# EAGLE design current_sensor (EAGLE 7.6.0)
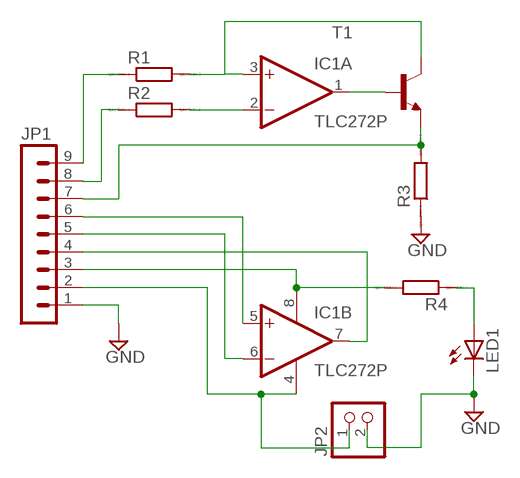
[diagram p0: schematic, sheet 1]

## Parts
IC1  TLC272P  [DIL08]
JP1  MA09-1  [MA09-1]
JP2  PINHD-1X2  [1X02]
LED1  LEDCHIP-LED0805  [CHIP-LED0805]
R1  R  [R0805]
R2  R  [R0805]
R3  R  [R0805]
R4  R  [R0805]
T1  BF422-NPN-TO92-BCE  [TO92-BCE]

## Nets
GND: JP1.1 JP2.2 LED1.C R3.1
N$1: JP1.7 R3.2 T1.E
N$2: IC1.1(A:OUT) T1.B
N$3: IC1.2(A:-IN) R2.2
N$4: IC1.3(A:+IN) R1.2 T1.C
N$5: JP1.9 R1.1
N$6: JP1.8 R2.1
N$7: LED1.A R4.1
N$8: IC1.5(B:+IN) JP1.6
N$9: IC1.6(B:-IN) JP1.5
N$10: IC1.7(B:OUT) JP1.4
N$12: IC1.4(P:V-) JP1.2 JP2.1
N$13: IC1.8(P:V+) JP1.3 R4.2

## Library data of the parts
IC1 = linear:TLC272: OP AMP
JP1 = con-lstb:MA09-1: PIN HEADER; OC_FARNELL: unknown; OC_NEWARK: unknown
JP2 = pinhead:PINHD-1X2: PIN HEADER
LED1 = led:LED: LED OSRAM: - CHIPLED LG R971, LG N971, LY N971, LG Q971, LY Q971, LO R971, LY R971 LH N974, LH R974 LS Q976, LO Q976, LY Q976 LO Q996 - Hyper CHIPLED LW Q18S LB Q993, LB Q99A, LB R99A - SideLED LS A670, LO A670, LY A670, LG A670, LP A670 LB A673, LV A673, LT A673, LW A673 LH A674 LY A675 LS A676, LA A676, LO A676, LY A676, LW A676 LS A679, LY A679, LG A679 - Hyper Micro SIDELED® LS Y876, LA Y876, LO Y876, LY Y876 LT Y87S - SmartLED LW L88C, LW L88S LB L89C, LB L89S, LG L890 LS L89K, LO L89K, LY L89K LS L896, LA L896, LO L896, LY L896 - TOPLED LS T670, LO T670, LY T670, LG T670, LP T670 LSG T670, LSP T670, LSY T670, LOP T670, LYG T670 LG T671, LOG T671, LSG T671 LB T673, LV T673, LT T673, LW T673 LH T674 LS T676, LA T676, LO T676, LY T676, LB T676, LH T676, LSB T676, LW T676 LB T67C, LV T67C, LT T67C, LS T67K, LO T67K, LY T67K, LW E67C LS E67B, LA E67B, LO E67B, LY E67B, LB E67C, LV E67C, LT E67C LW T67C LS T679, LY T679, LG T679 LS T770, LO T770, LY T770, LG T770, LP T770 LB T773, LV T773, LT T773, LW T773 LH T774 LS E675, LA E675, LY E675, LS T675 LS T776, LA T776, LO T776, LY T776, LB T776 LHGB T686 LT T68C, LB T68C - Hyper Mini TOPLED® LB M676 - Mini TOPLED Santana® LG M470 LS M47K, LO M47K, LY M47K Source: http://www.osram.convergy.de LUXEON: - LUMILED® LXK2-PW12-R00, LXK2-PW12-S00, LXK2-PW14-U00, LXK2-PW14-V00 LXK2-PM12-R00, LXK2-PM12-S00, LXK2-PM14-U00 LXK2-PE12-Q00, LXK2-PE12-R00, LXK2-PE12-S00, LXK2-PE14-T00, LXK2-PE14-U00 LXK2-PB12-K00, LXK2-PB12-L00, LXK2-PB12-M00, LXK2-PB14-N00, LXK2-PB14-P00, LXK2-PB14-Q00 LXK2-PR12-L00, LXK2-PR12-M00, LXK2-PR14-Q00, LXK2-PR14-R00 LXK2-PD12-Q00, LXK2-PD12-R00, LXK2-PD12-S00 LXK2-PH12-R00, LXK2-PH12-S00 LXK2-PL12-P00, LXK2-PL12-Q00, LXK2-PL12-R00 Source: www.luxeon.com KINGBRIGHT: KA-3528ASYC Source: www.kingbright.com
R1-R4 = eagle-ltspice:R: RESISTOR, European symbol; SPICEMODEL: NONE; SPICEPREFIX: R
T1 = transistor:*-NPN-: NPN Transistror BF959 corrected 2008.03.06

## Board
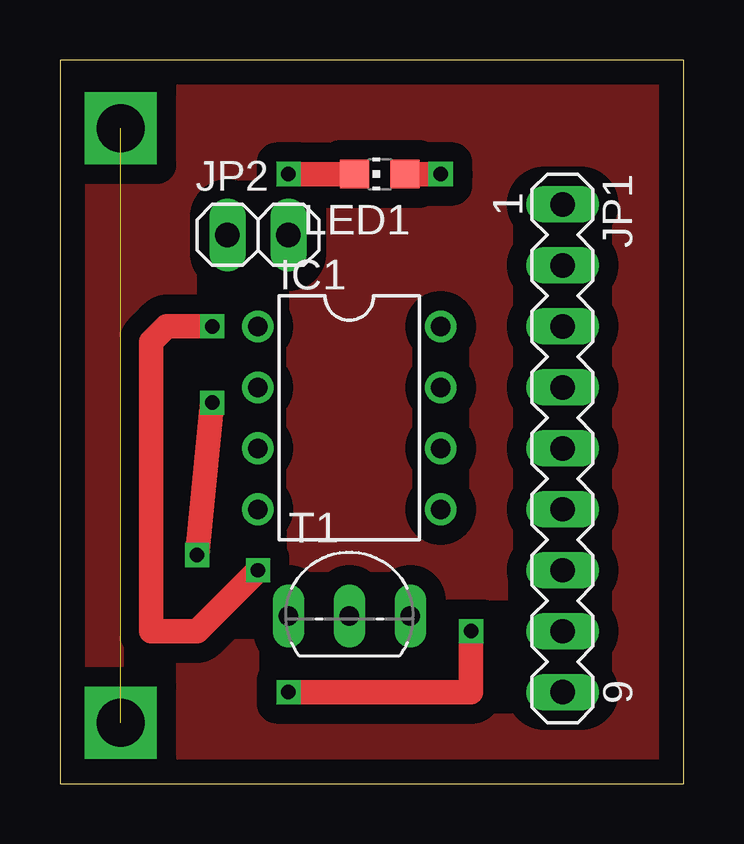
[diagram p1: board, top side]
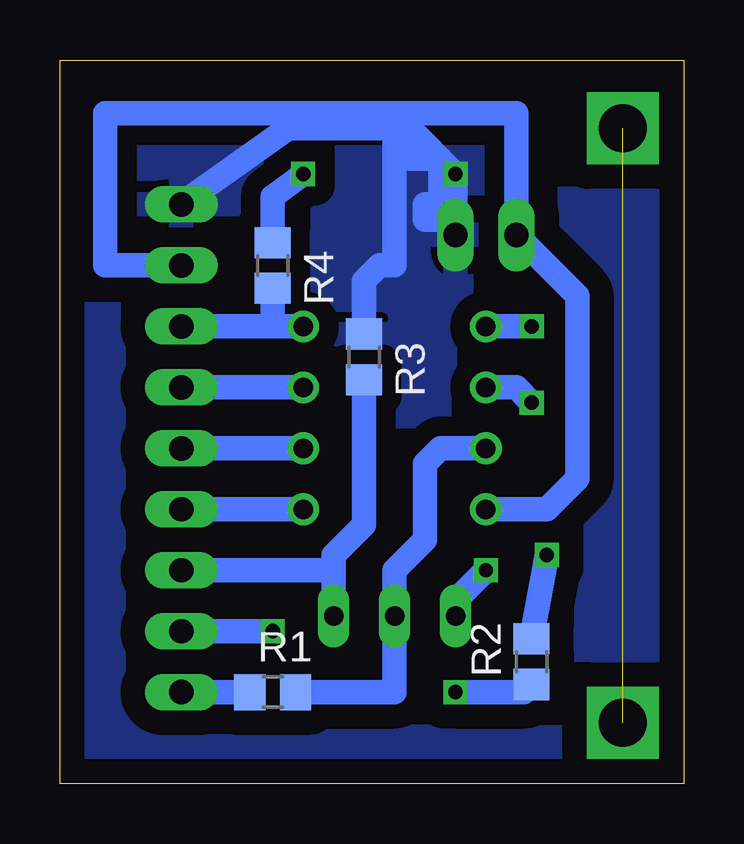
[diagram p2: board, bottom side, seen from below]

Size 26.02 x 30.15 mm. Coordinates in mm from the lower left corner, seen from the top.
Outline: 0,0 26.02,0 26.02,30.15 0,30.15 0,0
Copper layers (1*16): Top 0.035mm / dielectric 1.5mm / Bottom 0.035mm
Design rules "default": minimum track width 10mil, minimum drill 24mil, track to track 8mil, track to pad 8mil, pad to pad 8mil, via to via 8mil, smd to smd 8mil, copper to edge 40mil, drill to drill 8mil, minimum pad ring 10mil, minimum via ring 8mil, stop-mask expansion 4mil, vias tented up to drill 0mil, thermal gap 10mil

### Footprints (pad centres in the part's own frame; a part is rotated, then mirrored left to right if it is on the bottom)
DIL08 = drill 0.813 pad 1.27: 1 -3.81,-3.81; 2 -1.27,-3.81; 3 1.27,-3.81; 4 3.81,-3.81; 5 3.81,3.81; 6 1.27,3.81; 7 -1.27,3.81; 8 -3.81,3.81
MA09-1 = drill 1.016 long: 1 -10.16,0; 2 -7.62,0; 3 -5.08,0; 4 -2.54,0; 5 0,0; 6 2.54,0; 7 5.08,0; 8 7.62,0; 9 10.16,0
1X02 = drill 1.016 long: 1 -1.27,0; 2 1.27,0
CHIP-LED0805 = smd 1.2 x 1.2: A 0,-1.05; C 0,1.05
R0805 = smd 1.3 x 1.5: 1 -0.95,0; 2 0.95,0
TO92-BCE = drill 0.813 long: B -2.54,0; C 0,0; E 2.54,0

### Placement (x,y rotation side)
IC1  12.06,15.24 270 top
JP1  20.96,13.97 270 top
JP2  8.26,22.86 0 top
LED1  13.33,25.4 90 top
R1  17.15,3.81 0 bottom
R2  6.35,5.08 90 bottom
R3  13.33,17.78 270 bottom
R4  17.15,21.59 270 bottom
T1  12.06,6.99 0 top

### Tracks (layer width: path | path; a pad name or v marks a point on that pad's centre or on a via)
GND  (via drill 0.6)
  Top 1.016: LED1.C v9.53,25.4
  Bottom 1.016: v9.53,25.4 JP2.2 | R3.1 13.33,20.95 12.7,21.59 12.06,21.59 12.06,27.3 | 12.06,27.3 16.51,27.3 JP1.1 | 12.06,27.3 11.43,27.3 v9.53,25.4 | v9.53,25.4 9.53,24.13 10.79,24.13 10.79,23.5 10.16,23.5 10.16,26.04 11.43,26.04 11.43,26.67
  pour Bottom (isolate 0.813): -0.64,33.02 -0.64,-2.54 27.31,-2.54 27.31,33.02
N$1
  Bottom 1.016: T1.E 14.61,8.89 | 14.61,8.89 14.61,9.53 13.33,10.79 R3.2 | JP1.7 14.61,8.89
N$2  (via drill 0.6)
  Top 1.016: v8.26,8.89 5.71,6.35 3.81,6.35 3.81,18.41 4.45,19.05 v6.35,19.05
  Bottom 1.016: T1.B 9.53,7.62 v8.26,8.89 | v6.35,19.05 IC1.1
N$3  (via drill 0.6)
  Top 1.016: v5.71,9.53 v6.35,15.88
  Bottom 1.016: IC1.2 6.98,16.51 v6.35,15.88 | R2.2 v5.71,9.53
N$4
  Bottom 1.016: R1.2 12.06,3.81 T1.C 12.06,8.89 10.79,10.16 10.79,13.34 10.16,13.97 IC1.3
N$5
  Bottom 1.016: JP1.9 R1.1
N$6  (via drill 0.6)
  Top 1.016: v17.15,6.35 17.15,3.81 v9.53,3.81
  Bottom 1.016: JP1.8 v17.15,6.35 | v9.53,3.81 6.67,3.81 R2.1
N$7  (via drill 0.6)
  Top 1.016: LED1.A v15.88,25.4
  Bottom 1.016: v15.88,25.4 17.15,24.45 R4.1
N$8
  Bottom 1.016: JP1.6 IC1.5
N$9
  Bottom 1.016: IC1.6 JP1.5
N$10
  Bottom 1.016: JP1.4 IC1.7
N$12
  Bottom 1.016: JP1.2 24.13,21.59 24.13,27.94 6.98,27.94 JP2.1 4.45,20.32 4.45,12.7 5.71,11.43 IC1.4
N$13
  Bottom 1.016: IC1.8 17.15,19.05 | 17.15,19.05 JP1.3 | R4.2 17.15,19.05
N$14
  pour Bottom (isolate 1.016): -0.64,30.48 -0.64,0 26.04,0 26.04,30.48
N$15  (via drill 2)  (1 unrouted)
  other vias: 2.54,27.3 2.54,2.54
N$16
  pour Top (isolate 0.813): -0.64,30.48 -0.64,0 26.04,0 26.04,30.48